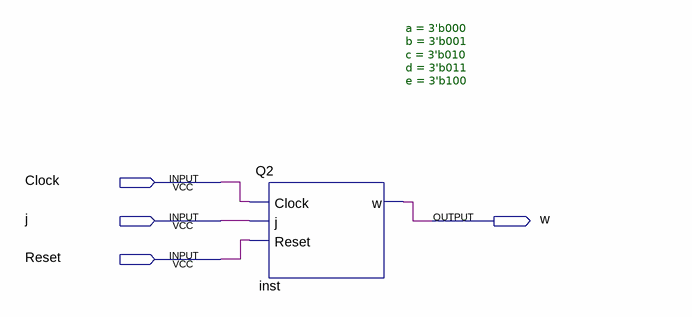
[diagram p0: schematic sheet]
// Quartus schematic Q2_BlockDiagram.bdf as structural Verilog: 1 symbols, 4 pins
module Q2_BlockDiagram (
  input  Clock,
  input  j,
  input  Reset,
  output w
);

  Q2 #(.a(3'b000), .b(3'b001), .c(3'b010), .d(3'b011), .e(3'b100)) inst (.Clock(Clock), .j(j), .Reset(Reset), .w(w));
endmodule
